# Altium project metalDetector555REALPCB.PrjPcb
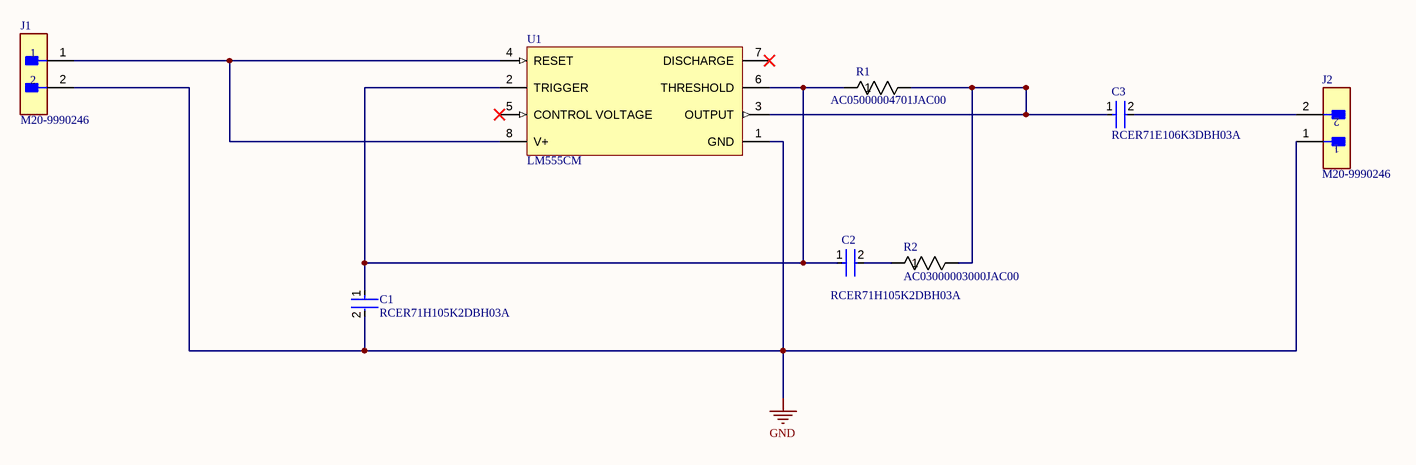
[diagram p0: Sheet1.SchDoc]
CAGE_CODE: ?????; CONTRACT_NUMBER: <CONTRACT NO>; DOC_NO_ASSY_DWG: <ASSY DWG NO>; DOC_NO_BOM: <BOM DOC NO>; DOC_NO_FAB_DWG: <FAB DWG NO>; DOC_NO_SCH_DWG: <SCH DWG NO>; PCB_2_DEC_TOL: +/-.01; PCB_3_DEC_TOL: +/-.010; PCB_ANG_TOL: +/-1/2; PCB_ASSEMBLY_NO: <PCB ASSY NO>; PCB_CHECKER: - -----; PCB_CHECKER_APP_DATE: --/--/----; PCB_DESIGNER: - -----; PCB_DESIGNER_APP_DATE: --/--/----; PCB_DWG_NO: <PCB DWG NO>; PCB_ENGINEER: - -----; PCB_ENGINEER_APP_DATE: --/--/----; PCB_PART_NUMBER: <PCB PN>; PCB_REV: A; SCH_REV: A
1 sheet, 8 parts. Net scope: global (net labels, ports and power ports of the same name join across sheets).
Board file: PCB1.PcbDoc

## Sheet Sheet1.SchDoc
size 431 x 279 mm; SheetNumber: 1; SheetTotal: 1; ENG_APP_DATE: --/--/--; DSN_APP_DATE: --/--/--; CHK_APP_DATE: --/--/--

### Parts
C1  RCER71H105K2DBH03A  [FP-RCE2A2-MFG]
C2  RCER71H105K2DBH03A  [FP-RCE2A2-MFG]
C3  RCER71E106K3DBH03A  [FP-RCE3DB-MFG]
J1  M20-9990246  [FP-M20-9990246-MFG]
J2  M20-9990246  [FP-M20-9990246-MFG]
R1  AC05000004701JAC00  [RES_AC05_VIS]
R2  AC03000003000JAC00  [RES_AC03_VIS]
U1  LM555CM  [D0008A_M]

### Nets
GND: C1.2 J1.2 J2.1 U1.1(GND)
NetC1_1: C1.1 C2.1 R1.1 U1.2(TRIGGER) U1.6(THRESHOLD)
NetC2_2: C2.2 R2.1
NetC3_1: C3.1 R1.2 R2.2 U1.3(OUTPUT)
NetC3_2: C3.2 J2.2
NetJ1_1: J1.1 U1.4(RESET) U1.8(V+)

Not connected (* = marked no-connect by the designer): U1 5(CONTROL_VOLTAGE)* 7(DISCHARGE)*

### Notes on the sheet
- DWG. NO.
- REV.
- SHT.
- THIS DOCUMENT AND THE DATA DISCLOSED HEREIN OR HEREWITH IS THE PROPERTY OF ALTIUM LIMITED AND MAY BE FREELY DISTRIBUTED IN WHOLE. NO RIGHTS ARE RESERVED OR EXPRESS OR IMPLIED WARANTEE GIVEN.
- REVISION
- DESCRIPTION
- DATE
- APPROVED
- ENG:
- APPROVALS
- PROJECT
- DSN:
- CHK:
- REFERENCE DOCUMENTS
- PROJECT REVISION:
- TITLE
- DOCUMENT REVISION:
- DESIGN ITEM:
- BOM:
- FAB DWG:
- PCB DWG:
- ASSY DWG:
- SCALE:
- SIZE
- B
- CAGE CODE
- FILE NAME
- DWG NO.
- SHEET
- OF
- REV

### Library data of the parts
C1 C2 = CMP-06035-042751-1: Cap Ceramic 1uF 50V X7R ±10% Radial 2.5mm +125°C Automotive Ammo Pack; Lead/Base Style: Straight; Lead Diameter: 0.5mm; Height - Seated (Max): 0.157inch; Height: 4mm; Voltage Rating (DC): 50V; Ratings: AEC-Q200; Width: 0.124inch; Dielectric: X7R; Mount: Through Hole; Termination: Radial; Case/Package: Radial; Length: 0.217inch; Tolerance: 10%; Lead Pitch: 0.098inch; Capacitance: 1uF; Resistor Type: Ceramic; Voltage Rating: 50V; Min Operating Temperature: -55°C; Packaging: Tape and Reel; Max Operating Temperature: 125°C; Package Quantity: 2000
C3 = CMP-06035-005830-1: Cap Ceramic 10uF 25V X7R ±10% Radial 2.5mm +125°C Automotive Ammo Pack; Lead/Base Style: Straight; Lead Diameter: 0.5mm; Case/Package: Radial; Voltage Rating (DC): 25V; Tolerance: 10%; Lead Pitch: 0.098inch; Termination: Radial; Height - Seated (Max): 0.197inch; Resistor Type: Ceramic; Min Operating Temperature: -55°C; Dielectric: X7R; Length: 0.217inch; Voltage Rating: 25V; Width: 0.157inch; Height: 5mm; Packaging: Tape and Reel; Ratings: AEC-Q200; Max Operating Temperature: 125°C; Package Quantity: 1500; Mount: Through Hole; Capacitance: 10uF
J1 J2 = CMP-15831-000009-1: CONN HEADER VERT 2POS 2.54MM; Manufacturer: Harwin; Conn Gender: Male; Description: Connector Header Through Hole 2 position 0.100" (2.54mm); Conn Orientation: Vertical; Number Of Contacts: 2; Current Rating: 3A; ComponentLink2URL: https://cdn.harwin.com/pdfs/M20-999.pdf; ComponentLink2Description: Datasheet; Package: M20-9990246; Temperature: -40°C to +105°C; Octopart: https://octopart.com/m20-9990246-harwin-2590635; Mouser Description: 2.54mm (0.1") Pitch SIL Vertical PC Tail Pin Header, 6.1mm mating pin height, tin, 2 contacts; Temperature Range High: +105°C; Device Class L1: Connectors; RoHS: TRUE; Automotive: No; Height: 8.99mm; Number Of Rows: 1; Contact Material: Tin,Nickel; Category: Conn; Pitch: 2.54mm; Lead Free: Yes; Digikey Description: CONN HEADER VERT 2POS 2.54MM; Manufacturer Part Number: M20-9990246; Temperature Range Low: -40°C; Device Class L3: unset; Device Class L2: Headers and Wire Housings
R1 = CMP-00030-39747417-1: AC05000004701JAC00 VISHAY AC05000004701JAC00 Through Hole Resistor, AC Series, 4.7 kohm, 5 W, 5%, Axial Leaded; Voltage Rating: 153V; Lead Diameter: 800µm; Max Power Dissipation: 5W; Resistance: 4.7kΩ; Temperature Coefficient: 180ppm/°C; Schedule B: 8533210080, 8533210080; REACH SVHC: Unknown; Voltage Rating (DC): 153V; NexarPartId: 39747417; RoHS: Compliant; Tolerance: 5%; Features: Flame Retardant Coating; Case/Package: Conformal; Diameter: 7.5mm; Number of Pins: 2; Number of Terminations: 2; Length: 18mm; Max Operating Temperature: 275°C; Lead Free: Lead Free; Termination: Axial; Packaging: Tape & Box (TB); Contact Plating: Tin; Radiation Hardening: No; Military Standard: Not; Min Operating Temperature: -40°C; Composition: Wirewound; Power Rating: 5W; Width: 7.49mm
R2 = CMP-00030-39746760-1: AC03000003000JAC00 Res Wirewound 300 Ohm 5% 3W -80ppm/C to -10ppm/C Conformal AXL Thru-Hole Ammo Pack; Voltage Rating (DC): 30V; Lead Diameter: 800µm; Temperature Coefficient: -80ppm/°C; Resistance: 300Ω; Max Operating Temperature: 275°C; Number of Pins: 2; Termination: Axial; Diameter: 4.8mm; Contact Plating: Tin; Packaging: Cut Tape (CT); Schedule B: 8533210080, 8533210080; Voltage Rating: 30V; Military Standard: Not; Max Power Dissipation: 3W; Composition: Wirewound; Power Rating: 3W; NexarPartId: 39746760; Tolerance: 5%; Case/Package: Axial; REACH SVHC: Unknown; Min Operating Temperature: -40°C; Thickness: 4.8006mm; Features: Flame Retardant Coating; Width: 4.8mm; Length: 13mm; RoHS: Compliant; Number of Terminations: 2
U1 = CMP-00023-00002-2: Highly Stable 555 Timer for Generating Accurate Time Delays and Oscillation, 4.5 to 16 V, 0 to 70 degC, 8-Pin SOIC (D), Tube; Manufacturer: Texas Instruments (TI); Package Version: 4040047-3/M, 06/2011; Frequency: 100kHz; Max Supply Voltage: 16V; Max Ouput Current: -200mA; Min Supply Voltage: 4.5V; Power: 1.18W; Nominal Supply Current: 3mA; Channels: 1; Manufacturer URL: http://www.ti.com/; Pins: 8; Packaging: Rail/Tube; Datasheet Version: SNAS548D, 01/2015; RoHS Compliant: True; Package URL: http://www.ti.com/lit/ml/msoi002j/msoi002j.pdf; Package Reference: D0008A; Package Quantity: 95; Datasheet URL: http://www.ti.com/lit/ds/symlink/lm555.pdf; Min Operating Temperature: 0°C; Mounting Technology: SM; Max Operating Temperature: 70°C; Case/Package: SOIC; Package Description: 8-Pin Small Outline Integrated Circuit, Body 4.9 x 3.9 mm, Pitch 1.27 mm